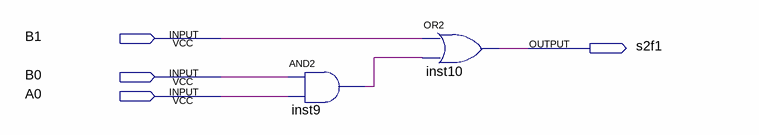
[diagram p0: schematic sheet]
// Quartus schematic s2f1.bdf as structural Verilog: 2 symbols, 4 pins
module s2f1 (
  input  B1,
  input  B0,
  input  A0,
  output s2f1
);

  wire inst9_out;

  and inst9 (inst9_out, B0, A0);
  or inst10 (s2f1, B1, inst9_out);
endmodule
